# EAGLE schematic hw_DAA (EAGLE 7.6.0), part 4 of 4
## Sheet 32 of 34: FPD-Link III Deserializer
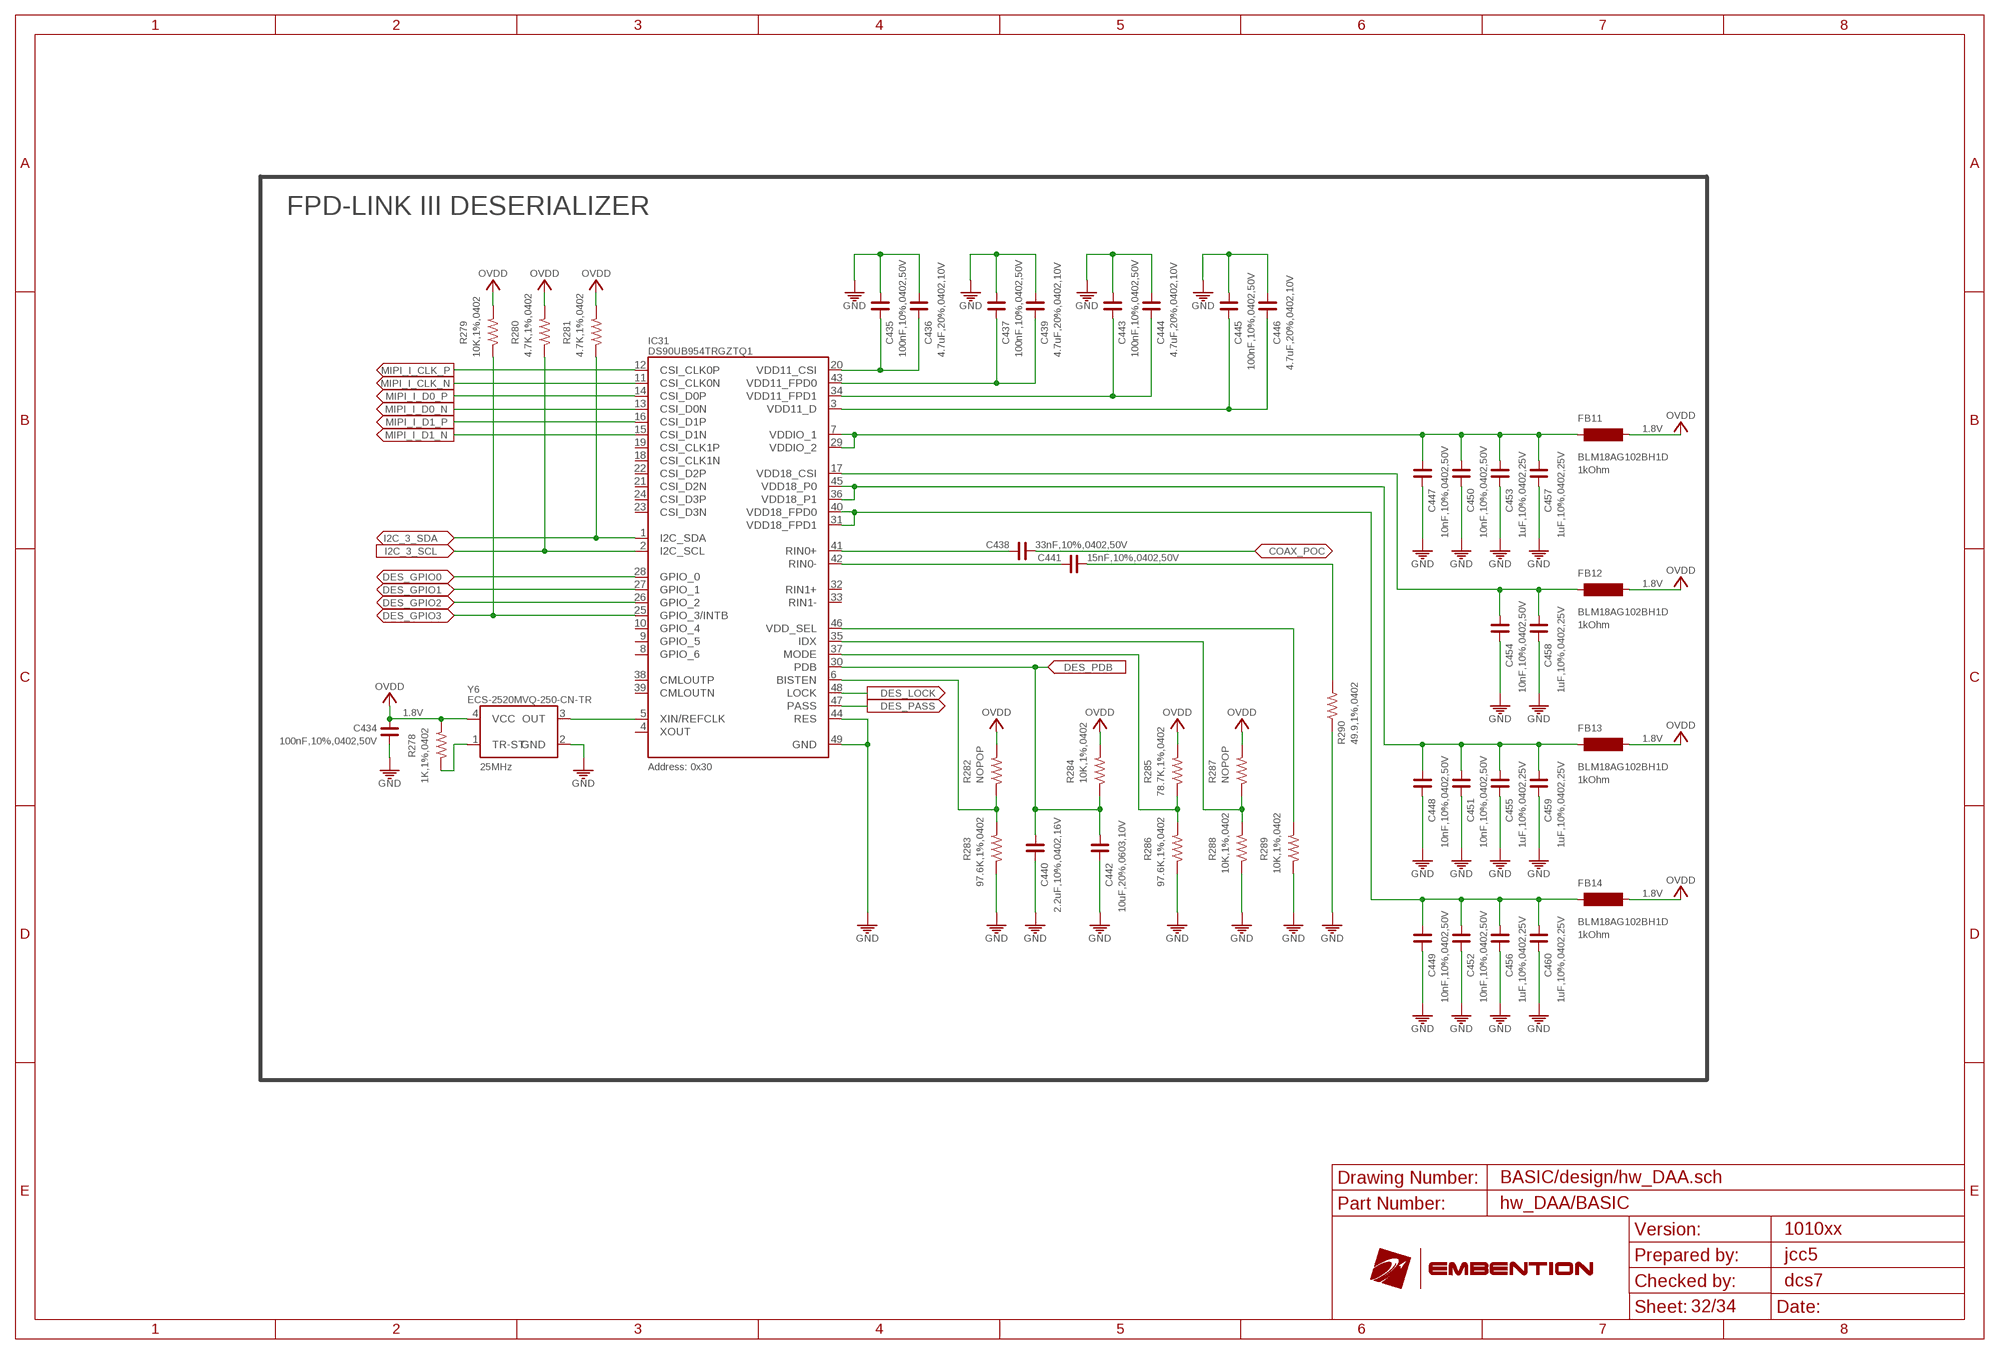
[diagram p31: schematic, sheet 32]

### Parts
C434  100nF,10%,0402,50V  C_0402  [C0402]
C435  100nF,10%,0402,50V  C_0402  [C0402]
C436  4.7uF,20%,0402,10V  C_0402  [C0402]
C437  100nF,10%,0402,50V  C_0402  [C0402]
C438  33nF,10%,0402,50V  C_0402  [C0402]
C439  4.7uF,20%,0402,10V  C_0402  [C0402]
C440  2.2uF,10%,0402,16V  C_0402  [C0402]
C441  15nF,10%,0402,50V  C_0402  [C0402]
C442  10uF,20%,0603,10V  C_0603  [C0603]
C443  100nF,10%,0402,50V  C_0402  [C0402]
C444  4.7uF,20%,0402,10V  C_0402  [C0402]
C445  100nF,10%,0402,50V  C_0402  [C0402]
C446  4.7uF,20%,0402,10V  C_0402  [C0402]
C447  10nF,10%,0402,50V  C_0402  [C0402]
C448  10nF,10%,0402,50V  C_0402  [C0402]
C449  10nF,10%,0402,50V  C_0402  [C0402]
C450  10nF,10%,0402,50V  C_0402  [C0402]
C451  10nF,10%,0402,50V  C_0402  [C0402]
C452  10nF,10%,0402,50V  C_0402  [C0402]
C453  1uF,10%,0402,25V  C_0402  [C0402]
C454  10nF,10%,0402,50V  C_0402  [C0402]
C455  1uF,10%,0402,25V  C_0402  [C0402]
C456  1uF,10%,0402,25V  C_0402  [C0402]
C457  1uF,10%,0402,25V  C_0402  [C0402]
C458  1uF,10%,0402,25V  C_0402  [C0402]
C459  1uF,10%,0402,25V  C_0402  [C0402]
C460  1uF,10%,0402,25V  C_0402  [C0402]
FB11  BLM18AG102BH1D  BLM18HE152SZ1D  [L0603]
FB12  BLM18AG102BH1D  BLM18HE152SZ1D  [L0603]
FB13  BLM18AG102BH1D  BLM18HE152SZ1D  [L0603]
FB14  BLM18AG102BH1D  BLM18HE152SZ1D  [L0603]
IC31  DS90UB954TRGZTQ1  DS90UB954-Q1  [VQFN-48]
R278  1K,1%,0402  R_0402  [R0402]
R279  10K,1%,0402  R_0402  [R0402]
R280  4.7K,1%,0402  R_0402  [R0402]
R281  4.7K,1%,0402  R_0402  [R0402]
R282  NOPOP  R_0402  [R0402]
R283  97.6K,1%,0402  R_0402  [R0402]
R284  10K,1%,0402  R_0402  [R0402]
R285  78.7K,1%,0402  R_0402  [R0402]
R286  97.6K,1%,0402  R_0402  [R0402]
R287  NOPOP  R_0402  [R0402]
R288  10K,1%,0402  R_0402  [R0402]
R289  10K,1%,0402  R_0402  [R0402]
R290  49.9,1%,0402  R_0402  [R0402]
Y6  ECS-2520MVQ-250-CN-TR  [ECS-2520MVQ]

### Nets
COAX_DES [COAX_50]: C438.1 IC31.41(RIN0+)
COAX_POC [COAX_50]: C438.2 ; also sheet 2,31
DES_GPIO0: IC31.28(GPIO_0) ; also sheet 17
DES_GPIO1: IC31.27(GPIO_1) ; also sheet 17
DES_GPIO2: IC31.26(GPIO_2) ; also sheet 17
DES_GPIO3: IC31.25(GPIO_3/INTB) R279.1 ; also sheet 17
DES_IDX: IC31.35(IDX) R287.1 R288.2
DES_LOCK: IC31.48(LOCK) ; also sheet 17
DES_MODE: IC31.37(MODE) R285.1 R286.2
DES_PASS: IC31.47(PASS) ; also sheet 17
DES_PDB: C440.1 C442.1 IC31.30(PDB) R284.1 ; also sheet 17
DES_VDD11_CSI: C435.2 C436.2 IC31.20(VDD11_CSI)
DES_VDD11_D: C445.2 C446.2 IC31.3(VDD11_D)
DES_VDD11_FPD0: C437.2 C439.2 IC31.43(VDD11_FPD0)
DES_VDD11_FPD1: C443.2 C444.2 IC31.34(VDD11_FPD1)
DES_VDD18_CSI: C454.1 C458.1 FB12.1 IC31.17(VDD18_CSI)
DES_VDD18_FPD: C449.1 C452.1 C456.1 C460.1 FB14.1 IC31.31(VDD18_FPD1) IC31.40(VDD18_FPD0)
DES_VDD18_P: C448.1 C451.1 C455.1 C459.1 FB13.1 IC31.36(VDD18_P1) IC31.45(VDD18_P0)
DES_VDD_SEL: IC31.46(VDD_SEL) R289.2
DES_VDDIO: C447.1 C450.1 C453.1 C457.1 FB11.1 IC31.7(VDDIO_1) IC31.29(VDDIO_2)
DES_XIN: IC31.5(XIN/REFCLK) Y6.3(OUT)
FPD_I_25MHZ_EN: R278.1 Y6.1(TR-ST)
FPD_I_BISTEN: IC31.6(BISTEN) R282.1 R283.2
GND: C434.2 C435.1 C436.1 C437.1 C439.1 C440.2 C442.2 C443.1 C444.1 C445.1 C446.1 C447.2 C448.2 C449.2 C450.2 C451.2 C452.2 C453.2 C454.2 C455.2 C456.2 C457.2 C458.2 C459.2 C460.2 IC31.44(RES) IC31.49(GND) R283.1 R286.1 R288.1 R289.1 R290.1 Y6.2(GND) ; also sheet 2,3,4,5,6,7,8,9,10,11,12,13,14,15,17,18,20,21,22,23,24,25,26,27,28,29,30,31,33
I2C_3_SCL: IC31.2(I2C_SCL) R280.1 ; also sheet 17
I2C_3_SDA: IC31.1(I2C_SDA) R281.1 ; also sheet 17
MIPI_I_CLK_N [DIFF100]: IC31.11(CSI_CLK0N) ; also sheet 17
MIPI_I_CLK_P [DIFF100]: IC31.12(CSI_CLK0P) ; also sheet 17
MIPI_I_D0_N [DIFF100]: IC31.13(CSI_D0N) ; also sheet 17
MIPI_I_D0_P [DIFF100]: IC31.14(CSI_D0P) ; also sheet 17
MIPI_I_D1_N [DIFF100]: IC31.15(CSI_D1N) ; also sheet 17
MIPI_I_D1_P [DIFF100]: IC31.16(CSI_D1P) ; also sheet 17
N$101: C441.2 IC31.42(RIN0-)
N$105: C441.1 R290.2
OVDD: C434.1 FB11.2 FB12.2 FB13.2 FB14.2 R278.2 R279.2 R280.2 R281.2 R282.2 R284.2 R285.2 R287.2 Y6.4(VCC) ; also sheet 9,28,29,30,31
Unconnected: IC31.4(XOUT) IC31.8(GPIO_6) IC31.9(GPIO_5) IC31.10(GPIO_4) IC31.18(CSI_CLK1N) IC31.19(CSI_CLK1P) IC31.21(CSI_D2N) IC31.22(CSI_D2P) IC31.23(CSI_D3N) IC31.24(CSI_D3P) IC31.32(RIN1+) IC31.33(RIN1-) IC31.38(CMLOUTP) IC31.39(CMLOUTN)

### Notes on the sheet
- FPD-LINK III DESERIALIZER
- 1.8V
- 1kOhm
- 1.8V
- 1kOhm
- 1.8V
- 1.8V
- 25MHz | Address: 0x30
- 1kOhm
- 1.8V
- 1kOhm
- BASIC/design/hw_DAA.sch
- hw_DAA/BASIC
- 1010xx
- jcc5
- dcs7

## Sheet 33 of 34: GPIO Level Shifter
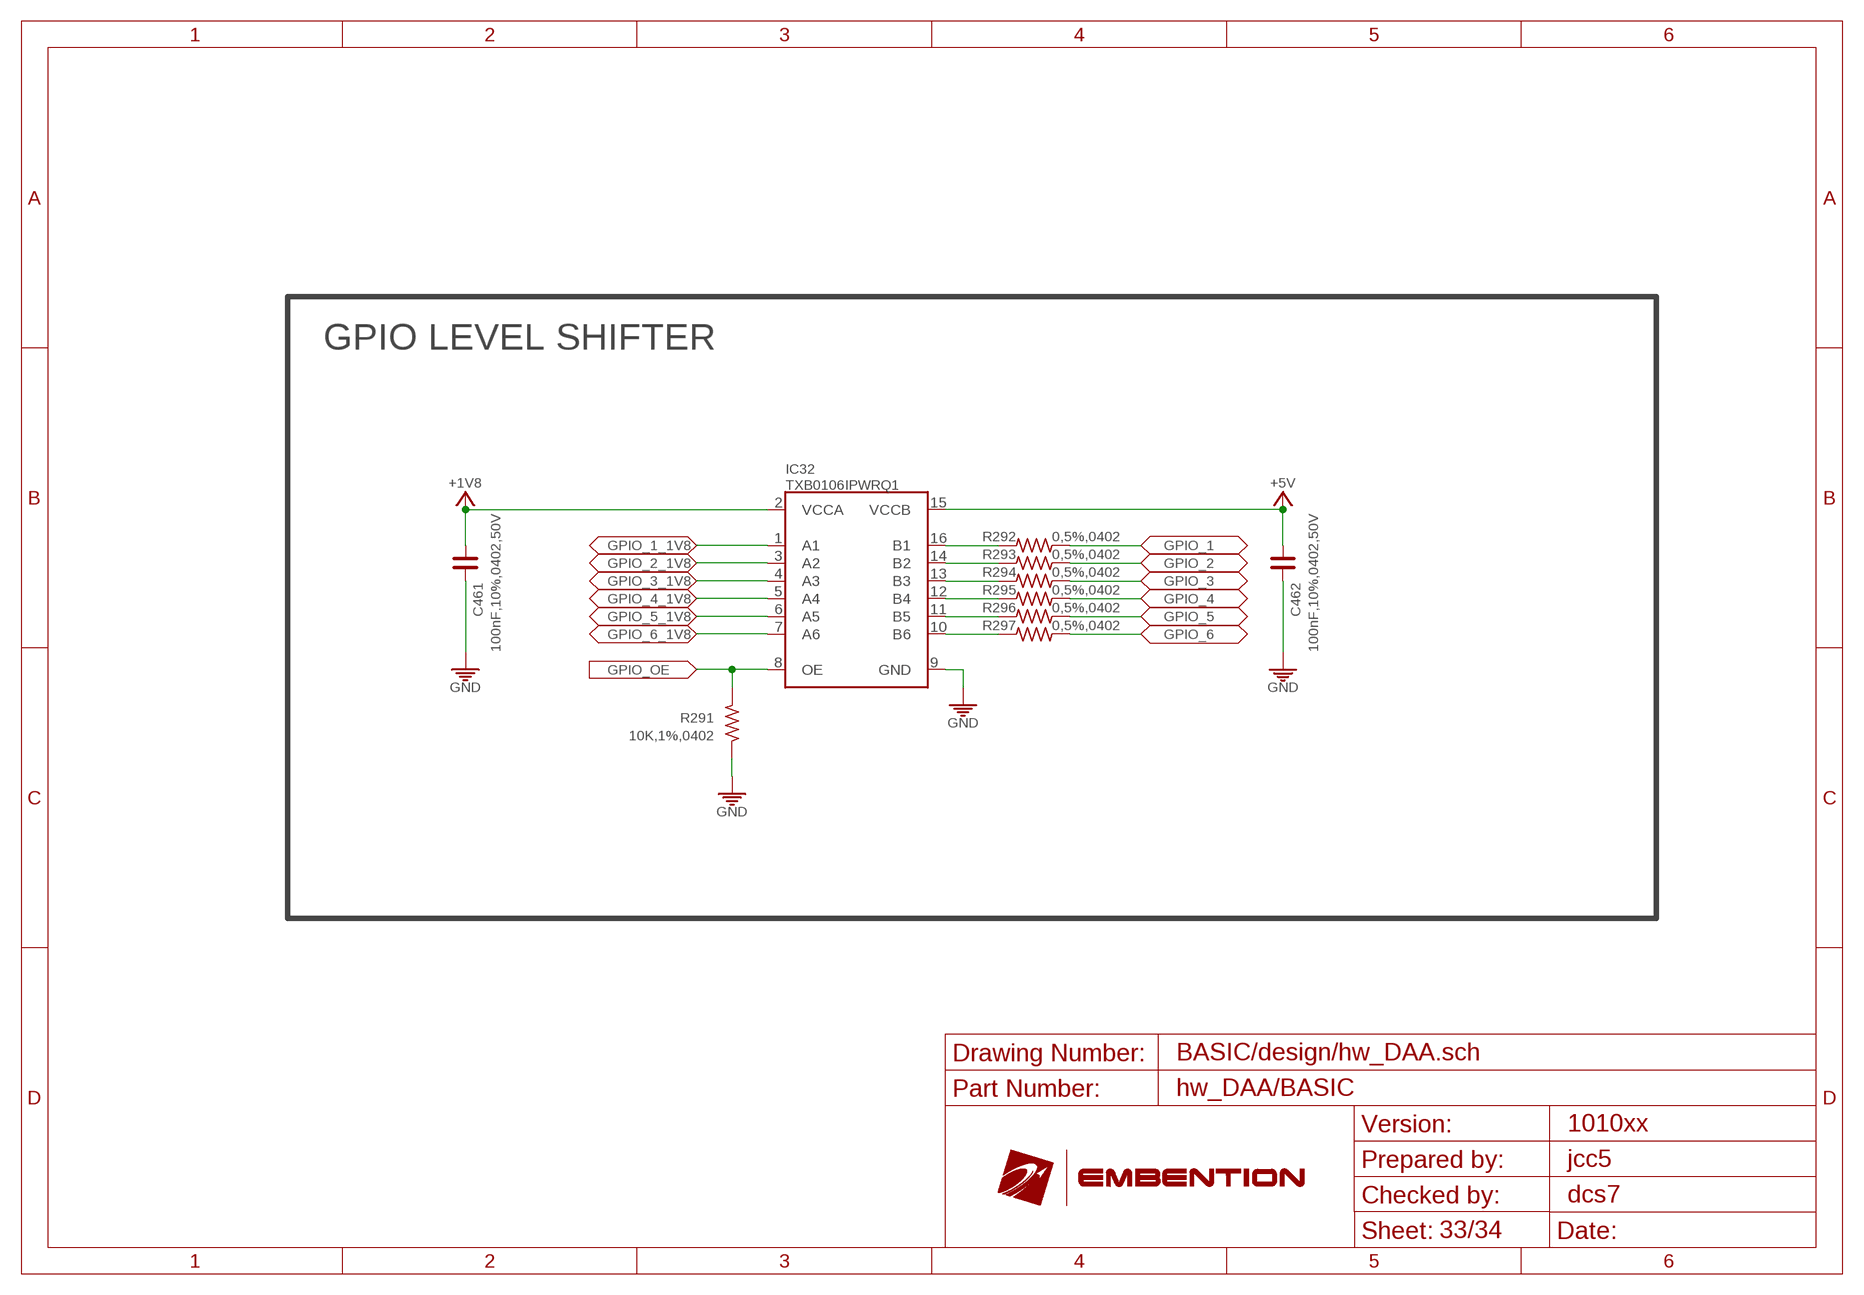
[diagram p32: schematic, sheet 33]

### Parts
C461  100nF,10%,0402,50V  C_0402  [C0402]
C462  100nF,10%,0402,50V  C_0402  [C0402]
IC32  TXB0106IPWRQ1  TXB0106-Q1  [TSSOP-16(TEXAS)]
R291  10K,1%,0402  R_0402  [R0402]
R292  0,5%,0402  R_0402  [R0402]
R293  0,5%,0402  R_0402  [R0402]
R294  0,5%,0402  R_0402  [R0402]
R295  0,5%,0402  R_0402  [R0402]
R296  0,5%,0402  R_0402  [R0402]
R297  0,5%,0402  R_0402  [R0402]

### Nets
+1V8: C461.1 IC32.2(VCCA) ; also sheet 5,24,27
+5V: C462.1 IC32.15(VCCB) ; also sheet 3,4,5,7,8,25,26
GND: C461.2 C462.2 IC32.9(GND) R291.1 ; also sheet 2,3,4,5,6,7,8,9,10,11,12,13,14,15,17,18,20,21,22,23,24,25,26,27,28,29,30,31,32
GPIO_1: R292.1 ; also sheet 2
GPIO_1_1V8: IC32.1(A1) ; also sheet 17
GPIO_2: R293.1 ; also sheet 2
GPIO_2_1V8: IC32.3(A2) ; also sheet 17
GPIO_3: R294.1 ; also sheet 2
GPIO_3_1V8: IC32.4(A3) ; also sheet 17
GPIO_4: R295.1 ; also sheet 2
GPIO_4_1V8: IC32.5(A4) ; also sheet 17
GPIO_5: R296.1 ; also sheet 2
GPIO_5_1V8: IC32.6(A5) ; also sheet 17
GPIO_6: R297.1 ; also sheet 2
GPIO_6_1V8: IC32.7(A6) ; also sheet 17
GPIO_OE: IC32.8(OE) R291.2 ; also sheet 17
N$145: IC32.16(B1) R292.2
N$146: IC32.10(B6) R297.2
N$148: IC32.11(B5) R296.2
N$149: IC32.12(B4) R295.2
N$150: IC32.13(B3) R294.2
N$151: IC32.14(B2) R293.2

### Notes on the sheet
- GPIO LEVEL SHIFTER
- BASIC/design/hw_DAA.sch
- hw_DAA/BASIC
- 1010xx
- jcc5
- dcs7

## Sheet 34 of 34: Mechanical Parts
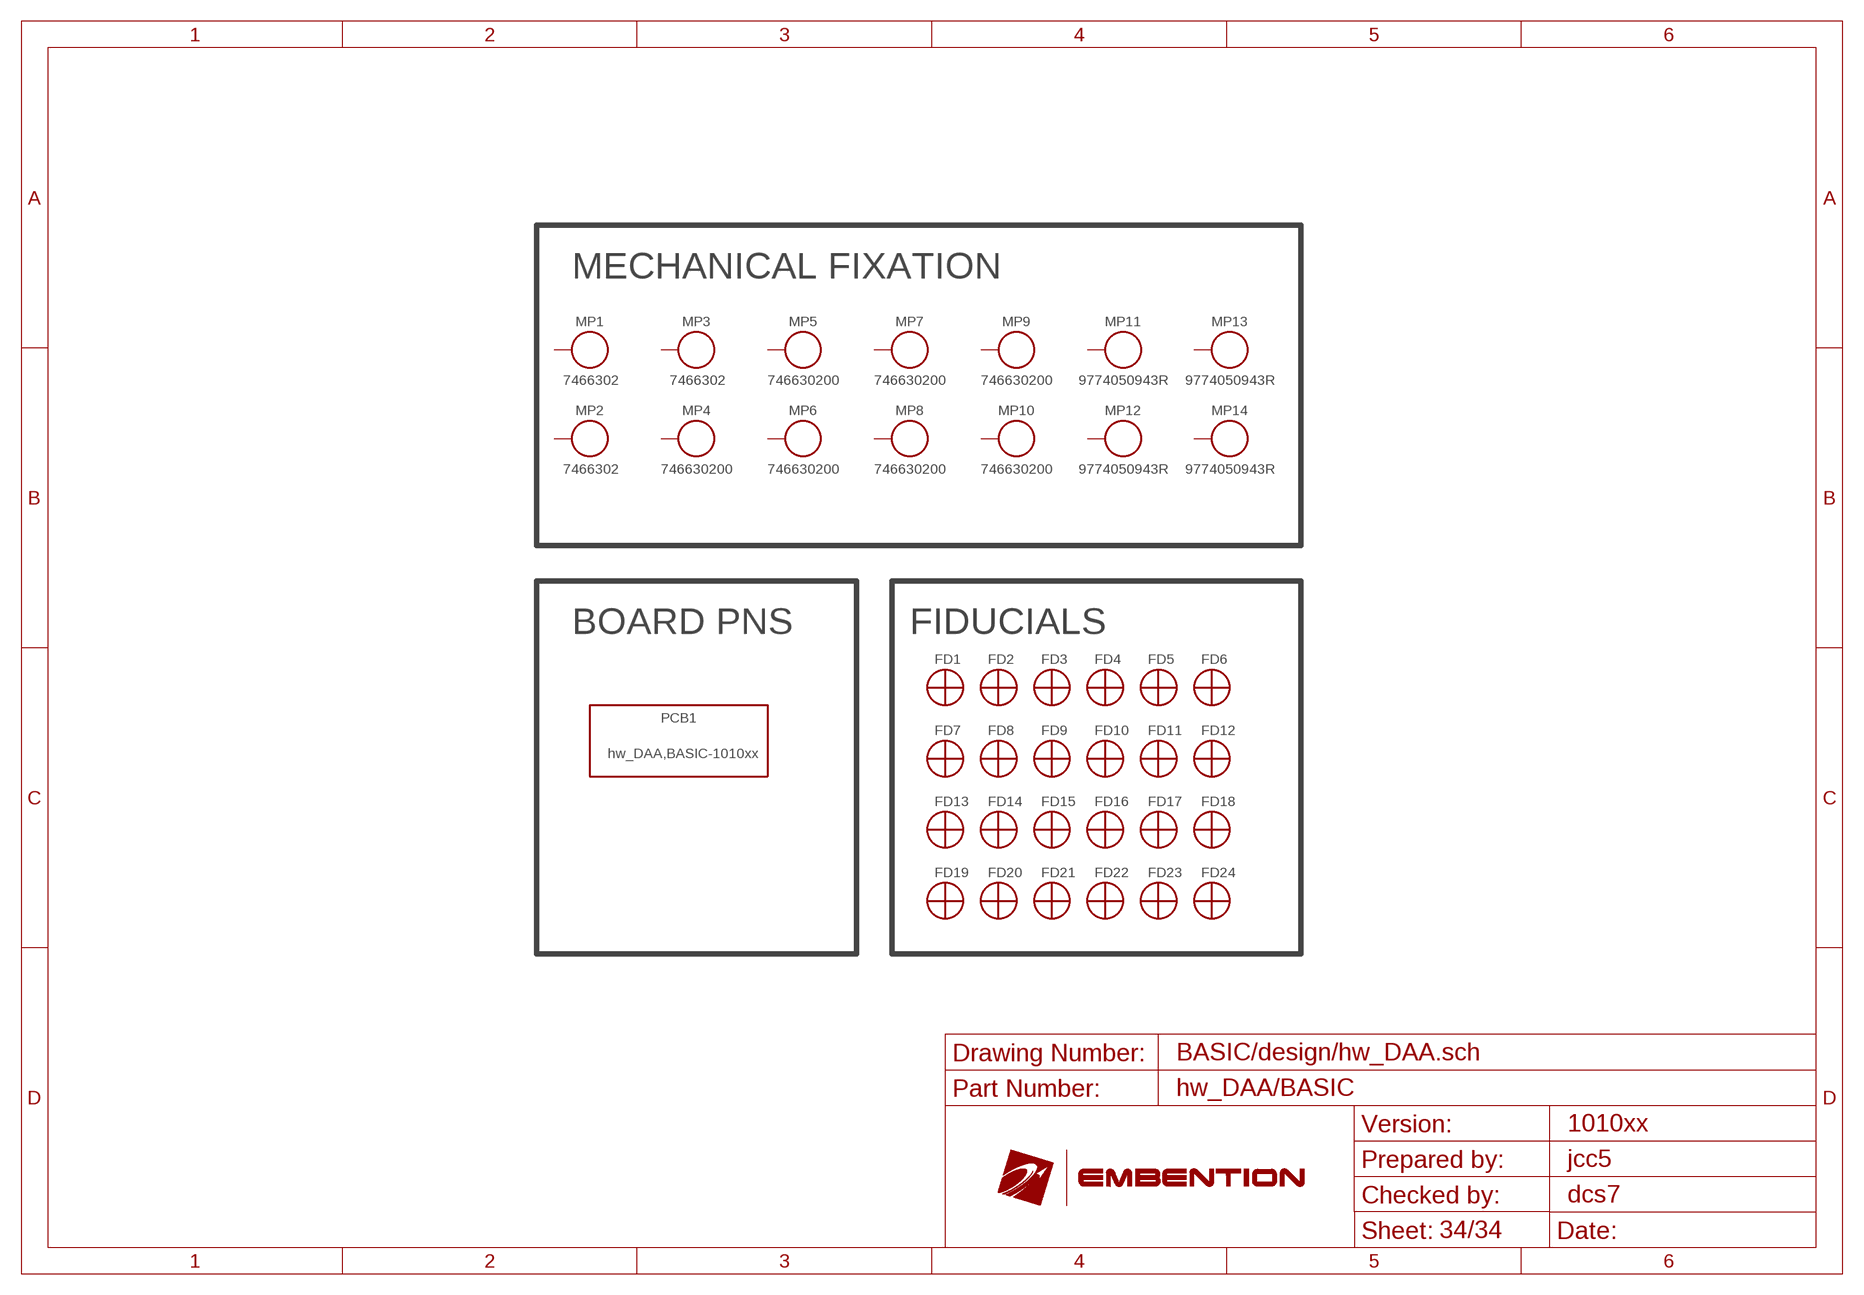
[diagram p33: schematic, sheet 34]

### Parts
FD1  NOPOP  FIDUCIAL  [FIDU]
FD2  NOPOP  FIDUCIAL  [FIDU]
FD3  NOPOP  FIDUCIAL  [FIDU]
FD4  NOPOP  FIDUCIAL  [FIDU]
FD5  NOPOP  FIDUCIAL  [FIDU]
FD6  NOPOP  FIDUCIAL  [FIDU]
FD7  NOPOP  FIDUCIAL  [FIDU]
FD8  NOPOP  FIDUCIAL  [FIDU]
FD9  NOPOP  FIDUCIAL  [FIDU]
FD10  NOPOP  FIDUCIAL  [FIDU]
FD11  NOPOP  FIDUCIAL  [FIDU]
FD12  NOPOP  FIDUCIAL  [FIDU]
FD13  NOPOP  FIDUCIAL  [FIDU]
FD14  NOPOP  FIDUCIAL  [FIDU]
FD15  NOPOP  FIDUCIAL  [FIDU]
FD16  NOPOP  FIDUCIAL  [FIDU]
FD17  NOPOP  FIDUCIAL  [FIDU]
FD18  NOPOP  FIDUCIAL  [FIDU]
FD19  NOPOP  FIDUCIAL  [FIDU]
FD20  NOPOP  FIDUCIAL  [FIDU]
FD21  NOPOP  FIDUCIAL  [FIDU]
FD22  NOPOP  FIDUCIAL  [FIDU]
FD23  NOPOP  FIDUCIAL  [FIDU]
FD24  NOPOP  FIDUCIAL  [FIDU]
MP1  7466302  WP-SMRA_746630X_746630200  [WP-SMRA_746630200]
MP2  7466302  WP-SMRA_746630X_746630200  [WP-SMRA_746630200]
MP3  7466302  WP-SMRA_746630X_746630200  [WP-SMRA_746630200]
MP4  746630200  WP-SMRA_746630X_746630200  [WP-SMRA_746630200]
MP5  746630200  WP-SMRA_746630X_746630200  [WP-SMRA_746630200]
MP6  746630200  WP-SMRA_746630X_746630200  [WP-SMRA_746630200]
MP7  746630200  WP-SMRA_746630X_746630200  [WP-SMRA_746630200]
MP8  746630200  WP-SMRA_746630X_746630200  [WP-SMRA_746630200]
MP9  746630200  WP-SMRA_746630X_746630200  [WP-SMRA_746630200]
MP10  746630200  WP-SMRA_746630X_746630200  [WP-SMRA_746630200]
MP11  9774050943R  WA-SMST_9774XXX943_9774050943R  [WA-SMST_9774050943]
MP12  9774050943R  WA-SMST_9774XXX943_9774050943R  [WA-SMST_9774050943]
MP13  9774050943R  WA-SMST_9774XXX943_9774050943R  [WA-SMST_9774050943]
MP14  9774050943R  WA-SMST_9774XXX943_9774050943R  [WA-SMST_9774050943]
PCB1  hw_DAA,BASIC-1010xx  EXTERNAL-PCB-COMPONENTS  [VOID]
Unconnected: MP1.1 MP1.2 MP1.3 MP1.4 MP2.1 MP2.2 MP2.3 MP2.4 MP3.1 MP3.2 MP3.3 MP3.4 MP4.1 MP4.2 MP4.3 MP4.4 MP5.1 MP5.2 MP5.3 MP5.4 MP6.1 MP6.2 MP6.3 MP6.4 MP7.1 MP7.2 MP7.3 MP7.4 MP8.1 MP8.2 MP8.3 MP8.4 MP9.1 MP9.2 MP9.3 MP9.4 MP10.1 MP10.2 MP10.3 MP10.4 MP11.1 MP12.1 MP13.1 MP14.1

### Notes on the sheet
- MECHANICAL FIXATION
- BOARD PNS | FIDUCIALS
- BASIC/design/hw_DAA.sch
- hw_DAA/BASIC
- 1010xx
- jcc5
- dcs7

## Library data of the parts
C1 C343 = emb-Capacitors:C_: NON-POLARIZED CAP; PNS: CAP-1nF_10%_1206_2KV.pns
C2 C110-C112 = emb-Capacitors:C_: NON-POLARIZED CAP; PNS: CAP-10uF_10%_1206_35V.pns
C3 C11 C16 C81 C82 C90 C92 = emb-Capacitors:C_: NON-POLARIZED CAP; PNS: CAP-100nF_10%_0603_100V.pns
C4 C115 C209 C212 C215 C218-C220 C222 C223 C237 C240 C243 C246-C248 C250 C251 C257 C258 C262 C263 C266-C268 C271-C275 C277 C278 C281-C283 C285 C289 C314 C317 C318 C321-C324 C326 C329 C336 C339 C361 C362 C368 C379 C383 C431-C433 C453 C455-C460 C495 = emb-Capacitors:C_: NON-POLARIZED CAP; PNS: CAP-1uF_10%_0402_25V.pns
C5 C18 C33 C36 C37 C39-C41 C46-C49 C116 C118 C123 C126 = emb-Capacitors:C_: NON-POLARIZED CAP; PNS: CAP-2.2uF_10%_0603_16V.pns
C6-C8 = emb-Capacitors:C_: NON-POLARIZED CAP; PNS: CAP-10uF_10%_2220_100V.pns
C9 C10 C79 C80 = emb-Capacitors:C_: NON-POLARIZED CAP; PNS: CAP-4.7uF_20%_1206_100V.pns
C12 = emb-Capacitors:C_: NON-POLARIZED CAP; PNS: CAP-56nF_10%_0402_16V.pns
C13 = emb-Capacitors:C_: NON-POLARIZED CAP; PNS: CAP-390pF_10%_0402_50V.pns
C14 C99 = emb-Capacitors:C_: NON-POLARIZED CAP; PNS: CAP-8.2nF_10%_0402_16V.pns
C15 C405 = emb-Capacitors:C_: NON-POLARIZED CAP; PNS: CAP-820pF_10%_0402_50V.pns
C17 = emb-Capacitors:C_: NON-POLARIZED CAP; PNS: CAP-6.8pF_5%_0603_100V.pns
C19 C20 = emb-Capacitors:C_: NON-POLARIZED CAP; PNS: CAP-6.8uF_20%_1210_50V.pns
C21 C22 C28 C50-C54 C56 C60-C62 C64 C65 C67 C68 C70 C71 C73 C87 C91 = emb-Capacitors:C_: NON-POLARIZED CAP; PNS: CAP-47uF_10%_1210_10V.pns
C23 C24 C96 = emb-Capacitors:C_: NON-POLARIZED CAP; PNS: CAP-2.7nF_5%_0603_50V.pns
C25 = emb-Capacitors:C_: NON-POLARIZED CAP; PNS: CAP-120pF_5%_0402_50V.pns
C26 C45 C76-C78 C101 C102 C117 C137 C173 C192 C193 C196 C197 C199 C221 C224-C228 C249 C252-C254 C276 C279 C280 C286 C287 C290-C292 C294-C296 C298 C299 C301-C306 C308-C313 C315 C316 C319 C320 C330 C331 C333 C334 C337 C340 C349-C351 C355-C360 C364-C367 C372-C375 C377 C380-C382 C384 C385 C387 C388 C390 C392-C396 C398 C399 C401 C402 C404 C411 C412 C415 C422 C424 C426 C434 C435 C437 C443 C445 C461 C462 C465 C468 C470 C472 C473 C478 C487-C491 C494 = emb-Capacitors:C_: NON-POLARIZED CAP; PNS: CAP-100nF_10%_0402_50V.pns
C27 C83 C93 C107 C124 C125 C175 C200 C288 C403 C416 C492 C493 = emb-Capacitors:C_: NON-POLARIZED CAP
C29 C30 C32 C35 C38 C113 C114 C119-C122 = emb-Capacitors:C_: NON-POLARIZED CAP; PNS: CAP-10uF_10%_0805_16V.pns
C31 C344 C348 C386 = emb-Capacitors:C_: NON-POLARIZED CAP; PNS: CAP-22uF_10%_1206_16V.pns
C34 C94 = emb-Capacitors:C_: NON-POLARIZED CAP; PNS: CAP-1uF_10%_0603_16V.pns
C42 C134 C171 C255 C463 C466 C469 C474 C476 C479 C481 C483 C485 = emb-Capacitors:C_: NON-POLARIZED CAP; PNS: CAP-470nF_10%_0402_16V.pns
C43 C44 = emb-Capacitors:C_: NON-POLARIZED CAP; PNS: CAP-12pF_5%_0402_50V.pns
C55 C57-C59 C63 C66 C69 C72 C74 C75 = emb-Capacitors:NFM18HC106D0G3L: NFM18HC106D0G3L 3-pin Filter Capacitor Capacitance: 10uF Voltage rating DC: 4V Tolerance: 20% Series code: C4AQ-M Temp: -55ºC to125ºC Qualification: AEC-Q200; PNS: CAP-10uF_20%_0603_4V_3L.pns
C84 C297 C300 = emb-Capacitors:C_: NON-POLARIZED CAP; PNS: CAP-4.7nF_20%_0402_100V.pns
C85 = emb-Capacitors:C_: NON-POLARIZED CAP; PNS: CAP-10pF_1%_0402_50V.pns
C86 C108 C109 = emb-Capacitors:C_: NON-POLARIZED CAP; PNS: CAP-100uF_20%_1210_6.3V.pns
C88 C89 C104 C105 C293 C327 C332 C338 C342 C345 C352 C369 C371 C378 C418 C420 C423 C427 C442 = emb-Capacitors:C_: NON-POLARIZED CAP; PNS: CAP-10uF_20%_0603_10V.pns
C95 C98 = emb-Capacitors:C_: NON-POLARIZED CAP; PNS: CAP-3.3nF_10%_0402_50V.pns
C97 C100 C194 C195 = emb-Capacitors:C_: NON-POLARIZED CAP; PNS: CAP-22pF_0.25pF_0402_50V.pns
C103 C408 = emb-Capacitors:C_: NON-POLARIZED CAP; PNS: CAP-220nF_10%_0402_35V.pns
C106 = emb-Capacitors:C_: NON-POLARIZED CAP; PNS: CAP-330pF_10%_0402_50V.pns
C127 C140 C152 C155 C156 C158 C159 C163 = emb-Capacitors:C_: NON-POLARIZED CAP; PNS: CAP-47uF_20%_0603_4V.pns
C128 C141-C143 C145-C148 C151 C153 C154 C157 C162 C165 C166 C169 C170 C174 C176-C178 C180 C181 C185 C187 = emb-Capacitors:C_: NON-POLARIZED CAP; PNS: CAP-10uF_20%_0402_4V.pns
C129 C160 = emb-Capacitors:C_: NON-POLARIZED CAP; PNS: CAP-330uF_20%_1210_2.5V.pns
C130-C133 C136 C161 C164 C167 C168 C172 C179 C182-C184 C186 C188-C190 = emb-Capacitors:C_: NON-POLARIZED CAP; PNS: CAP-100uF_20%_0805_4V.pns
C135 C138 C139 C144 C149 C150 C201-C208 C210 C211 C229-C236 C238 C239 C259-C261 C264 C265 C346 C347 C353 C354 C363 C370 C376 C389 C391 C397 C400 C406 C407 C409 C410 C436 C439 C444 C446 = emb-Capacitors:C_: NON-POLARIZED CAP; PNS: CAP-4.7uF_20%_0402_10V.pns
C191 = emb-Capacitors:C_: NON-POLARIZED CAP; PNS: CAP-33pF_5%_0402_50V.pns
C198 = emb-Capacitors:C_: NON-POLARIZED CAP; PNS: CAP-100pF_5%_0402_50V.pns
C213 C214 C216 C217 C241 C242 C244 C245 C269 C270 C417 C440 = emb-Capacitors:C_: NON-POLARIZED CAP; PNS: CAP-2.2uF_10%_0402_16V.pns
C256 C464 C467 C471 C475 C477 C480 C482 C484 C486 = emb-Capacitors:C_: NON-POLARIZED CAP; PNS: CAP-68nF_10%_0402_50V.pns
C284 C307 C325 C328 C335 C341 C413 C421 C425 C428-C430 C447-C452 C454 = emb-Capacitors:C_: NON-POLARIZED CAP; PNS: CAP-10nF_10%_0402_50V.pns
C414 = emb-Capacitors:C_: NON-POLARIZED CAP; PNS: CAP-22nF_10%_0402_50V.pns
C419 C441 = emb-Capacitors:C_: NON-POLARIZED CAP; PNS: CAP-15nF_10%_0402_50V.pns
C438 = emb-Capacitors:C_: NON-POLARIZED CAP; PNS: CAP-33nF_10%_0402_50V.pns
CN1 = emb-Connectors:HEW.LM.368.XLNP: LEMO Connector 68 pin HEW.LM.368.XLNP Fixed receptacle, nut fixing, watertight with straight contact for printed circuit, Female Contact Drawing Rev. 00 Source: http://www.lemo.com/catalog/ROW/UK_English/M_series.pdf; MPN: HEW.LM.368.XLNP; OC_FARNELL: unknown; OC_NEWARK: unknown
CN2 = emb-Connectors:132203-18: 132203-18 RF CONN Connector Style SMA Connector Type Jack, Female Socket Impedance 50Ohm Mounting Type Panel Mount, Through Hole, Right Angle Frequency - Max 12.4 GHz Ingress Protection IP67 - Dust Tight, Waterproof Operating Temperature -65°C ~ 165°C; PNS: CONN-132203-18.pns
CN3 CN5 = emb-Connectors:CLP-105-02-F-D-BE: CLP-105-02-F-D-BE Connector SAMTEC Current Rating: 3.4 A Voltage Rating: 280 VAC, 395 VDC Pitch: 1.27 mm Mounting Angle: Vertical Bottom Entry Temperature: -55ºC to 125ºC; PNS: CONN-CLP-105-02-F-D-BE.pns
CN4 = emb-Connectors:CLP-106-02-F-D-BE: CLP-106-02-F-D-BE Connector SAMTEC Current Rating: 3.4 A Voltage Rating: 280 VAC, 395 VDC Pitch: 1.27 mm Mounting Angle: Vertical Bottom Entry Temperature: -55ºC to 125ºC; PNS: CONN-CLP-106-02-F-D-BE.pns
CN6 = emb-Connectors:SD-LATCH: SD Holder Card Type: microSD Pitch: 1.1 mm Brand: Molex Temperature: -20ºC to 85ºC Same components as 47219-2001 but with 4-bit SDIO interface; PNS: CONN-47219-2001_.pns
CN7 = emb-Connectors:SFW15S-2STE1LF: SFW15S-2STE1LF Amphenol FFC/FPC Connector Number of contacts: 15 Number of rows: 2 Pitchs: 1mm Temperature range: -55ºC to 105ºC Voltage rating: 100V Rated current: 1A
D1 D2 = emb-diodes:SZ1SMA36CAT3G: SZ1SMA36CAT3G Product Type: TVS Diodes Polarity: Bidirectional Working Voltage: 36 V Package/Case: SMA-2 Pppm - Peak Pulse Power Dissipation: 400 W Vesd - Voltage ESD Contact: 16 kV Vesd - Voltage ESD Air Gap: 16 kV Temperature: -65ºC to 150ºC Qualification: AEC-Q101; PNS: DIO-SMA6J64CA.pns
D3 D4 = emb-diodes:PESD2CANFD27V-UX: PESD2CANFD27V-UX CAN-FD TVS Polarity: Bidirectional Number of Channels: 2 Channel Working Voltage: 27 V Clamping Voltage: 33 V Breakdown Voltage: 38 V Package/Case: SOT323-3 Ipp - Peak Pulse Current: 2.5 A Cd - Diode Capacitance: 5.2 pF Qualification: AEC-Q101 Temperature: -55ºC to 175ºC; PNS: DIO-PESD2CANFD27V-UX.pns
D5 = emb-diodes:SP712-02HTG: SP712-02HTG ESD Suppressor / TVS Diode Polarity: Bidirectional Working Voltage: 12V/7V Number of Channels: 2 Channel Package/Case: SOT-23-3 Breakdown Voltage: 13.3V/7.5V Clamping Voltage: 20V/ Pppm - Peak Pulse Power Dissipation: 500 W Vesd - Voltage ESD Contact: 30 kV Vesd - Voltage ESD Air Gap: 30 kV Ipp - Peak Pulse Current: 20 A Qualification: AEC-Q101 Temperature: -40ºC to 150ºC; PNS: DIO-PESD15VL2BT-QR.pns
D6 D7 = emb-diodes:SP712-02HTG: SP712-02HTG ESD Suppressor / TVS Diode Polarity: Bidirectional Working Voltage: 12V/7V Number of Channels: 2 Channel Package/Case: SOT-23-3 Breakdown Voltage: 13.3V/7.5V Clamping Voltage: 20V/ Pppm - Peak Pulse Power Dissipation: 500 W Vesd - Voltage ESD Contact: 30 kV Vesd - Voltage ESD Air Gap: 30 kV Ipp - Peak Pulse Current: 20 A Qualification: AEC-Q101 Temperature: -40ºC to 150ºC; PNS: DIO-SP712-02HTG.pns
D8 D9 = emb-diodes:PMEG10030ELPX: PMEG10030ELPX Product: Schottky Rectifiers Package/Case: SOD-128-2 If - Forward Current: 3 A Vrrm - Repetitive Reverse Voltage: 100 V Vf - Forward Voltage: 710 mV Temperature: -55ºC to 175ºC Qualification: AEC-Q101 Pd - Power Dissipation: 2.5 W; PNS: DIO-STPS5H100AFY.pns
D10-D12 D26 = emb-diodes:GSOT05C-HE3-08: GSOT05C-HE3-08 TVS Diode Working Voltage: 5V Breakdown Voltage: 6V Clamping Voltage: 16V Polarity: Unidirectional Package/Case: SOT-23-3 Power - Peak Pulse: 480W Qualification: AEC-Q101 Temperature: -40ºC to 250ºC; PNS: DIO-GSOT05C-HE3-08.pns
D13 = emb-diodes:PESD0402-140: PESD0402-140 ESD Suppressor Working Voltage: 14 V Clamping Voltage: 40 V Vesd - Voltage ESD Contact: 8 kV Vesd - Voltage ESD Air Gap: 15 kV Cd - Diode Capacitance: 0.25 pF Temperature: -55ºC to 125ºC Qualification: AEC-Q200 Package: 0402
D14 D15 = emb-diodes:BZD27C10P-HE3-08: BZD27C10P-HE3-08 Zener diode Product Category: Zener Diodes Vz - Zener Voltage: 10 V Package/Case: DO-219AB-2 Voltage Tolerance: 5 % Pd - Power Dissipation: 800 mW Temperature: -65ºC to 175ºC Qualification: AEC-Q101; PNS: DIO-BZD27C10P-HE3-08.pns
D16-D18 D20-D22 D28 = emb-diodes:RCLAMP3324PQTCT: RCLAMP3324PQTCT Unidirectional TVS Polarity: Unidirectional Number of Channels: 4 Channel Working Voltage: 3.3 V Clamping Voltage: 4.5 V Breakdown Voltage: 8 V Package/Case: DFN-2510-10 Ipp - Peak Pulse Current: 4.5 A Cd - Diode Capacitance: 0.65 pF Qualification: AEC-Q100 Temperature: -40ºC to 125ºC; PNS: DIO-RCLAMP3324PQTCT.pns
D19 = emb-diodes:BZT52C3V3-7-F: BZT52C3V3-7-F Zener Diode Vz - Zener Voltage: 3.3 V Package/Case: SOD-123-2 Pd - Power Dissipation: 500 mW Zener Current: 5 mA Qualification: AEC-Q101 Temperature range: -65ºC to 150ºC; PNS: DIO-BZT52C3V3-7-F.pns
D23 = emb-diodes:AQ4020-01FTG: AQ4020-01FTG Polarity: Unidirectional Working Voltage: 3.3 V Package/Case: SOD-323-2 Breakdown Voltage: 3.5 V Clamping Voltage: 21.8 V Pppm - Peak Pulse Power Dissipation: 750 W Vesd - Voltage ESD Contact: 30 kV Vesd - Voltage ESD Air Gap: 30 kV Ipp - Peak Pulse Current: 25 A Cd - Diode Capacitance: 2.5 pF Temperature: -40ºC to 125ºC Qualification: AEC-Q101; PNS: DIO-AQ4020-01FTG.pns
D24 D25 D27 = emb-diodes:HSP051-4M10: HSP051-4M10 Product Type: ESD Suppressors Polarity: Unidirectional Working Voltage: 3.6 V Number of Channels: 4 Channel Package/Case: USON-10 Breakdown Voltage: 5.8 V Clamping Voltage: 10V Vesd - Voltage ESD Contact: 8 kV esd - Voltage ESD Air Gap: 15 kV Cd - Diode Capacitance: 0.55 pF Temperature: -40ºC to 150ºC; PNS: DIO-HSP051-4M10.pns
FB1-FB3 = emb-Ferrites:BLM18HE152SZ1D: BLM18HE152SZ1D Rated Current: 500 mA Impedance @ 100 MHz: 1500 Ohms DC Resistance: 500 mOhms Manufacturer: Murata; PNS: FER-BLM18HE152SZ1D.pns
FB4-FB7 = emb-Ferrites:BLM15PX121SH1D: BLM15PX121SH1D Rated Current: 2 A Impedance @ 100 MHz: 120 Ohms DC Resistance: 55 mOhms Qualification: AEC-Q200; PNS: FER-BLM15PX121SH1D.pns
FB8-FB14 = emb-Ferrites:BLM18HE152SZ1D: BLM18HE152SZ1D Rated Current: 500 mA Impedance @ 100 MHz: 1500 Ohms DC Resistance: 500 mOhms Manufacturer: Murata; PNS: FER-BLM18AG102BH1D.pns
FD1-FD24 = emb-Others:FIDUCIAL: FIDUCIAL 1.3MM
IC1 = emb-IC:LM5146-Q1: LM5146-Q1 100-V Synchronous Buck DC/DC Controller With Wide Duty Cycle Range Input Voltage DCDC: 5.5V to 100V Output Voltage: 0.8V to 60V Package: VQFN-20 Temperature range: -40ºC to 125ºC Qualification:AEC-Q100; PNS: IC-LM5146QRGYRQ1.pns
IC2 IC8 = emb-IC:TPS57112C-Q1: TPS57112C-Q1 Automotive 2.95-V to 6-V, 2-A, 2-MHz Synchronous Buck Converter Input Voltage DCDC: 2.95V to 6V Input Voltage LDO: 1.6V to 6V Output Voltage: Ajustable Interfaces: DDR2, DDR3, DDR3L, DDR4 Package: WQFN-16 Temperature range: -40ºC to 150ºC Qualification:AEC-Q100; PNS: IC-TPS57112CQRTERQ1.pns
IC3 = emb-IC:TPS6593-Q1: TPS6593-Q1 Power Management IC (PMIC) with 5 BUCKs and 4 LDOs for SafetyRelevant Automotive Applications Input Voltage 3V to 5.5V Output Voltage: Ajustable Package: VQFNP-56 Temperature range: -40ºC to 125ºC Qualification:AEC-Q100; PNS: IC-TPS65930400RWERQ1.pns
IC4 = emb-IC:TCA9517-Q1: TCA9517-Q1 Level-Shifting I2C Bus Repeater Voltage Input A: 0.9V to 5.25V Voltage Input B: 2.7V to 5.25V Package/Case: VSSOP-8 Qualification: AEC-Q100; PNS: IC-TCA9517DGKRQ1.pns
IC5 = emb-IC:TS5A23157-Q1: TS5A23157-Q1 Dual 15-Ω SPDT Analog Switch Input Voltage DCDC: 1.8V to 5.5V Protocols: Analog, I2C, LVDS, UART Configuration: 2:1 SPDT Ron (typ) (Ω): 15 Number of channels: 2 Package: VSSOP-10 Temperature range: -40ºC to 125ºC Qualification:AEC-Q100; PNS: IC-TS5A23157TDGSRQ1.pns
IC6 = emb-IC:TPS62873-Q1: TPS62873-Q1 2.7-V to 6-V Input, 6-A, 9-A, 12-A, 15-A, Stackable, Synchronous StepDown Converters with Fast Transient Response Input Voltage: 2.7V to 6V Output Voltage: Ajustable Output Current: 15A Package: WQFN-16 Temperature range: -40ºC to 150ºC Qualification:AEC-Q100; PNS: IC-TPS62873QWRXSRQ1.pns
IC7 = emb-IC:TPS54116-Q1: TPS54116-Q1 2.95-V to 6-V Input, 4-A Step-Down Converter and 1-A Source/Sink DDR Termination Regulator Input Voltage DCDC: 2.95V to 6V Input Voltage LDO: 1.6V to 6V Output Voltage: Ajustable Interfaces: DDR2, DDR3, DDR3L, DDR4 Package: WQFN-24 Temperature range: -40ºC to 150ºC Qualification:AEC-Q100; PNS: IC-TPS54116QRTWTQ1.pns
IC9 = emb-IC:TPS650330-Q1: TPS650330-Q1 Automotive Camera PMIC Input Voltage DCDC: 4V to 18V Input Voltage LDO: 1.6V to 6V Output Voltage: Ajustable Interfaces: DDR2, DDR3, DDR3L, DDR4 Package: VQFN-24 Temperature range: -40ºC to 125ºC Qualification:AEC-Q100; PNS: IC-TPS65033000RGERQ1.pns
IC10 = emb-IC:TPS745-Q1: TPS745-Q1 Automotive, 500-mA LDO With Power-Good in Small Wettable Flank WSON Packages Input Voltage: 1.5V to 6V Output Voltage: Adjustable/Fixed Package: VSON-8 Temperature range: -40ºC to 150ºC Qualification:AEC-Q100; PNS: IC-TPS74525PQWDRBRQ1.pns
IC11 = emb-IC:XCZU15EG-FFVB1156: XCZU15EG-FFRB1156 Xilinx SoC FPGA Family: Zynq Ultrascale+ MPSoC Sub-Family: EG (Broad Device Range for Next-Generation Applications) Package: FFVB1156 Application Processing Unit: Quad-core Arm® Cortex®-A53 MPCore™ up to 1.5GHz Real-Time Processing Unit: Dual-core Arm Cortex-R5F MPCore™ up to 600MHz Graphics Processing Unit: Arm Mali™-400 MP2 up to 667MHz Dynamic Memory Interface: DDR4, LPDDR4, DDR3, DDR3L, LPDDR3 High-Speed Peripherals: PCIe® Gen2, USB3.0, SATA 3.1, DisplayPort, Gigabit Ethernet System Logic Cells: 747K Total RAM: 69Mb DSP Slices: 3528 16.3 Gb/s Transceivers: 24 32.75 Gb/s Transceivers: 0 PCI Express: 0 Maximum I/O Pins: 328; PNS: IC-XCZU15EG-2FFVB1156I.pns
IC12 = emb-IC:SN74LVC1G08QDCKRQ1: SN74LVC1G08QDCKR-Q1 Texas instruments AND gate Logic Function: AND Number of Gates: 1 Gate Supply Voltage range: 1.65V to 5.5V Temperature: -40ºC to 125ºC Package/Case: SC70-5 Qualification: AEC-Q100; PNS: IC-SN74LVC1G08QDCKRQ1.pns
IC13 = emb-IC:TMP451-Q1: TMP451A-Q1 Digital Temperature Sensor with Two-Wire Interface and Alert Sensing: Remote and Local Accuracy: ±1°C Resolution: 12bits Package: WSON-8 Temperature range: -40ºC to 125ºC Qualification:AEC-Q100; PNS: IC-TMP451HQDQFRQ1.pns
IC14-IC18 = emb-IC:MT40A1G16TD-062E: MT40A1G16TD-062E Micron DDR4 SDRAM Configuration: 1Gbx16 Density: 16Gb Bus Width: x16 Timing - Cycle time: DDR4-3200 Package: 96-ball FBGA; PNS: IC-MT40A1G16TD-062E AAT_F.pns
IC19 = emb-IC:SN74LVC1G04QDCKRQ1: SN74LVC1G04QDCKRQ1 Automotive single 1.65-V to 5.5-V inverter Logic Function: Inverting Number of Gates: 1 Gate Supply Voltage range: 1.65V to 5.5 V Temperature: -40ºC to 125ºC Package/Case: SC70-5 Qualification: AEC-Q100; PNS: IC-SN74LVC1G04QDCKRQ1.pns
IC20 = emb-IC:NVT4858HK: NVT4858HK SD 3.0-SDR104 compliant integrated auto-direction control without internal LDO Supply Voltage range: 1.1V to 3.6V Temperature: -40ºC to 85ºC Package/Case: XQFN16; PNS: IC-NVT4858HK.pns
IC21 IC22 = emb-IC:TPS2291XX: TPS2291xx Ultra-small, Low On Resistance Load Switch With Controlled Turn-on Input Voltage 1.4V to 5.5V Package: DSBGA-4 Temperature range: -40ºC to 85ºC; PNS: IC-TPS22910AYZVR.pns
IC23 IC24 = emb-IC:TCAN1462V-Q1: TCAN1462V-Q1 CAN FD Transceiver Package/Case: SOIC-8/VSON-8 Input Voltage: 1.7V to 5.5V Data Rate: 5Mbps; PNS: IC-TCAN1462VDRBRQ1.pns
IC25 = emb-IC:SN65HVD33: SN65HVD30MDREP RS-485 Transceiver Data Rate: 25 Mb/s Duplex: Full Duplex Package: SOIC-14 Temperature range: -55ºC to 125ºC; PNS: IC-SN65HVD33MDREP.pns
IC26 = emb-IC:SN65C3221-Q1: SN65C3221-Q1 Automotive 3- to 5.5-V single channel 1Mbps RS-232 line driver/receiver Channels: 1 Data Rate: 1 MbPs Package: TSSOP-16 Temperature range: -40ºC to 85ºC; PNS: IC-SN65C3221IPWRQ1.pns
IC27 = emb-IC:DP83867ERGZ: DP83867ERGZ Robust, High Immunity, Small Form Factor 10/100/1000 Ethernet Physical Layer Transceiver Package/Case: VQFN-48 Interface: RGMII and SGMII Data Rate: 100BASE-TX and 1000BASE-T; PNS: IC-DP83867ERGZT.pns
IC28 = emb-IC:IMX296: IMX290LQR-C CMOS Solid-state Image Sensor with Square Pixel for Color Cameras Package/Case: LGA-138 Interface: MIPI (2-lanes) ans I2C Imagen Resolution: 1440x1080 ADC Converter: 10bit; PNS: IC-IMX296LQR-C.pns
IC29 = emb-IC:BMI088: BMI088 IMU combining accelerometer and gyroscope Package/Case: LGA-16 Supply Voltage: 3.3V, 1,8V Interface: I2C, SPI Data Rate: 2kHz; PNS: IC-BMI088.pns
IC30 = emb-IC:DS90UB953-Q1: DS90UB953-Q1 FPD-Link III 4.16-Gbps Serializer With CSI-2 Interface Package/Case: VQFN-32 Interface: CSI-2 Data Rate: 4.16Gbps; COPYRIGHT: Copyright (C) 2023 Ultra Librarian. All rights reserved.; MANUFACTURER_PART_NUMBER: DS90UB953TRHBRQ1; MFR_NAME: Texas Instruments
IC31 = emb-IC:DS90UB954-Q1: DS90UB954-Q1 Dual 4.16 Gbps FPD-Link III Deserializer Hub With MIPI CSI-2 Outputs Package/Case: VQFN-48 Interface: CSI-2 Data Rate: 1.6Gbps; PNS: IC-DS90UB954TRGZTQ1.pns
IC32 = emb-IC:TXB0106-Q1: TXB0106-Q1 6-Bit Bidirectional Voltage-Level Translator With Auto-Direction Sensing and ±10-kV ESD Protection Supply Voltage Range Port A: 1.2V to 3.6V Supply Voltage Range Port B: 1.65V to 5.5V Direction: Bidirectional Number of I/O: 6 Temperature: -40ºC to 85ºC Package/Case: TSSOP-16 Qualification: AEC-Q100; PNS: IC-TXB0106IPWRQ1.pns
L1 = emb-Inductors:NLCV32T-100K-EFRD: NLCV32T-100K-EFRD Inductance: 10 uH Tolerance: 10 % Maximum DC Current: 450 mA Maximum DC Resistance: 360 mOhms Temperature: -40ºC to 105ºC Qualification: AEC-Q200; PNS: IND-10uH_10%_450mA.pns
L2 L3 = emb-Inductors:XAL7030: XAL7030 Series Inductors; PNS: IND-4.7uH_20%_9A.pns
L4 = emb-Inductors:XAL50XX: XAL50xx Series Inductors; PNS: IND-2.2uH_20%_9.7A.pns
L5 L8 L9 = emb-Inductors:TFM322512ALMA; PNS: IND-220nH_20%_7A.pns
L6 L7 = emb-Inductors:TFM322512ALMA; PNS: IND-470nH_20%_5.3A.pns
L10 = emb-Inductors:XAL4020: XAL4020 Series Inductors; PNS: IND-100nH_20%_19.9A.pns
L11 = emb-Inductors:XAL4020: XAL4020 Series Inductors; PNS: IND-600nH_20%_11.7A.pns
L12 = emb-Inductors:XAL4020: XAL4020 Series Inductors; PNS: IND-1.5uH_20%_9.1A.pns
L13 = emb-Inductors:L201610: Inductors for power circuits 2mm x 1.6mm; PNS: IND-1.5uH_20%_2.3A.pns
L14 L15 = emb-Inductors:L201610: Inductors for power circuits 2mm x 1.6mm; PNS: IND-1uH_20%_3.1A.pns
L16 L17 = emb-Inductors:1812CAN: 1812CAN Series Common Mode Chokes Qualification: AEC-Q200 Package/Case: 1812 (4532 metric) Temperature: -40ºC to 125ºC Tolerance: 30 %; PNS: IND-1812CAN-113NRC.pns
MP1-MP3 = emb-Others:WP-SMRA_746630X: 746630X SMT Right Angled without Pins Dimmensions: 5mm x 7mm x 5mm Material: Brass Surface: Tin Torque: 0.4 Nm Rated Current: 50A Metric: M2 to M3; DATASHEET-URL: https://www.we-online.de/katalog/datasheet/746630200.pdf; HEIGHT: 5mm; LENGTH: 7mm; PART-NUMBER: 746630200; PNS: OTHER-7466302.pns; THREAD: M2; WIDTH: 5mm
MP4-MP10 = emb-Others:WP-SMRA_746630X: 746630X SMT Right Angled without Pins Dimmensions: 5mm x 7mm x 5mm Material: Brass Surface: Tin Torque: 0.4 Nm Rated Current: 50A Metric: M2 to M3; DATASHEET-URL: https://www.we-online.de/katalog/datasheet/746630200.pdf; HEIGHT: 5mm; LENGTH: 7mm; PART-NUMBER: 746630200; PNS: OTHER-746630200.pns; THREAD: M2; WIDTH: 5mm
MP11-MP14 = emb-Others:WA-SMST_9774XXX943: WA-SMST Steel Spacer with through hole Ø2.25 Applications Assembling of PCBs to housing and to other PCBs For distances from 1 to 8 mm Fast and precise process Strong holding forces and torques Highest process reliability Instant removable Polyimide Tape Properties Material Steel Surface Tin Ø f 2.25 mm Solder Paste Thickness 150 µm General Information Operating Temperature -55 up to +150 °C Details see: https://www.we-online.com/catalog/en/SMST_SMD_STEEL_SPACER_2_25_INTERNAL_NON_STOP Updated by Ella Wu , 2021-06-09 2021 (C) Wurth Elektronik; DATASHEET-URL: https://www.we-online.com/catalog/datasheet/9774050943R.pdf; HOLE-DIAMETER: 2.25mm; INNER-DIAMETER: 2.8mm; OUTER-DIAMETER: 4.35mm; PACKAGING: Tape and Reel; PART-NUMBER: 9774050943R; PIN-LENGTH: 5mm; PNS: OTHER-9774050943R.pns; VALUE: D2.25x5mm
OP1-OP4 = emb-IC:TLP3431: TLP3431(TP,F MOSFET Output Optocouplers Photorelay Package/Case: VSON-4 Isolation Voltage: 500 Vrms If - Forward Current: 10 mA Vf - Forward Voltage: 1.27 V Vr - Reverse Voltage: 5 V Temperature: -40ºC to 110ºC Brand: Toshiba; PNS: IC-TLP3431(TP,F.pns
OP5 OP6 = emb-IC:TLP3431: TLP3431(TP,F MOSFET Output Optocouplers Photorelay Package/Case: VSON-4 Isolation Voltage: 500 Vrms If - Forward Current: 10 mA Vf - Forward Voltage: 1.27 V Vr - Reverse Voltage: 5 V Temperature: -40ºC to 110ºC Brand: Toshiba; PNS: IC-TLP3475(TP,F.pns
PCB1 = emb-Others:EXTERNAL-PCB-COMPONENTS: PCB symbol for board BOM; PNS: OTHER-hw_DAA,BASIC-1010xx.pns
Q1 = emb-TransistorsMOSFET:SQJ465EP-T1_GE3: SQJ465EP-T1_GE3 Automotive P-Channel -60 V (D-S) 175 °C MOSFET VDS (V) = -60 VGS (V) = +-20 RDS(on) (mΩ) at VGS = -10 V = 70 RDS(on) (mΩ) at VGS = -4.5 V = 90 ID (A) = -8 Package = SO-8L; PNS: TRAN-SQJ465EP-T1_GE3.pns
Q2 = emb-TransistorsMOSFET:BSS123NH6327XTSA1: BSS123NH6327XTSA1 N-Channel MOSFET Transistor Polarity: N-Channel Package/Case: SOT-23-3 Vds - Drain-Source Breakdown Voltage: 100 V Id - Continuous Drain Current: 190 mA Rds On - Drain-Source Resistance: 6 Ohms Vgs - Gate-Source Voltage: - 20 V, + 20 V Vgs th - Gate-Source Threshold Voltage: 1.4 V Qualification: AEC-Q101 Temperature: -55ºC to 150ºC; PNS: TRAN-BSS123NH6327XTSA1.pns
Q3 Q4 = emb-TransistorsMOSFET:SQJ402EP-T1_GE3: SQJ402EP Automotive N-Channel 100 VDS 175 °C MOSFET VDS (V) = 100 RDS(on) (Ω) at VGS = 10 V = 0.011 ID (A) = 30 Package = PowerPAK SO-8L; PNS: TRAN-SQJ402EP-T1_GE3.pns
Q5 = emb-TransistorsMOSFET:DMP2006UFGQ-13: DMP2006UFGQ-13 Diodes Incorporated Transistor Polarity: P-Channel Vds - Drain-Source Breakdown Voltage: 20 V Id - Continuous Drain Current: 40 A Rds On - Drain-Source Resistance: 5.5 mOhms Vgs - Gate-Source Voltage: - 10 V, + 10 V Vgs th - Gate-Source Threshold Voltage: 1 V Qualification: AEC-Q101 Temperature: -55ºC to 150ºC; PNS: TRAN-DMP2006UFGQ-13.pns
Q6-Q20 = emb-TransistorsMOSFET:DMN2710UTQ-7: DMN2710UTQ-7 N-MOSFET Transistor Polarity: N-Channel Vds - Drain-Source Breakdown Voltage: 20 V Id - Continuous Drain Current: 870 mA Rds On - Drain-Source Resistance: 450 mOhms Vgs - Gate-Source Voltage: - 6 V, + 6 V Vgs th - Gate-Source Threshold Voltage: 0.5 V Qualification: AEC-Q101 Temperature: -55ºC to 150ºC; PNS: TRAN-DMN2710UTQ-7.pns
R1 = emb-resistors:R_: RESISTOR; PNS: RES-1M_1%_1206.pns
R2 R222 R338 = emb-resistors:R_: RESISTOR; PNS: RES-0_1%_0805.pns
R3 = emb-resistors:R_: RESISTOR; PNS: RES-4.02_1%_1206.pns
R4 R7 R17 R55 R57 R58 R60 R65 R266 = emb-resistors:R_: RESISTOR; PNS: RES-100K_1%_0402.pns
R5 R8 = emb-resistors:R_: RESISTOR; PNS: RES-49.9K_1%_0805.pns
R6 = emb-resistors:R_: RESISTOR; PNS: RES-100_2%_0207_MELF.pns
R9 R10 = emb-resistors:R_: RESISTOR; PNS: RES-1_1%_1206.pns
R11 = emb-resistors:R_: RESISTOR; PNS: RES-2.1_1%_0603.pns
R12 = emb-resistors:R_: RESISTOR; PNS: RES-39.2K_1%_0402.pns
R13 = emb-resistors:R_: RESISTOR; PNS: RES-18K_1%_0402.pns
R14 = emb-resistors:R_: RESISTOR; PNS: RES-3.4K_1%_0402.pns
R15 = emb-resistors:R_: RESISTOR; PNS: RES-133_1%_0402.pns
R16 R219 = emb-resistors:R_: RESISTOR; PNS: RES-1.5K_1%_0402.pns
R18 R22 R46 R54 R71 R73 R75 R77 R80 R81 R93 R97 R103 R106 R109 R113 R115 R117 R118 R124 R201 R202 R211 R213 R226-R233 R237 R249 R250 R255-R264 R268 R270 R272 R275 R282 R287 R298 R299 R346-R353 R356 R357 = emb-resistors:R_: RESISTOR
R19 = emb-resistors:R_: RESISTOR; PNS: RES-931_1%_0603.pns
R20 R23 R24 R40-R42 R45 R48 R52 R53 R56 R61 R63 R67 R68 R78 R79 R126 R165 R167 R171 R175-R177 R182-R184 R189-R193 R205-R208 R234 R236 R240 R241 R243 R244 R274 R276 R279 R284 R288 R289 R291 R301 = emb-resistors:R_: RESISTOR; PNS: RES-10K_1%_0402.pns
R21 R30-R32 R35-R39 R69 R70 R72 R74 R88 R98 R125 R168 R169 R209 R242 R245-R248 R251-R254 R267 R269 R271 R292-R297 R322-R329 R332 R339-R345 = emb-resistors:R_: RESISTOR; PNS: RES-0_5%_0402.pns
R25 R59 = emb-resistors:R_: RESISTOR; PNS: RES-8.66K_1%_0402.pns
R26 = emb-resistors:R_: RESISTOR; PNS: RES-20K_1%_0402.pns
R27 = emb-resistors:R_: RESISTOR; PNS: RES-154K_1%_0402.pns
R28 R283 R286 = emb-resistors:R_: RESISTOR; PNS: RES-97.6K_1%_0402.pns
R29 R285 = emb-resistors:R_: RESISTOR; PNS: RES-78.7K_1%_0402.pns
R33 R34 R43 R44 R90 R92 R94 R95 R99 R102 R104 R105 R107 R108 R110-R112 R114 R116 R119 R127-R131 R158-R160 R238 R239 R280 R281 R300 R302-R304 R354 R355 = emb-resistors:R_: RESISTOR; PNS: RES-4.7K_1%_0402.pns
R47 = emb-resistors:R_: RESISTOR; PNS: RES-15K_1%_0603.pns
R49 R50 = emb-resistors:R_: RESISTOR; PNS: RES-6.19K_1%_0603.pns
R51 = emb-resistors:R_: RESISTOR; PNS: RES-909_1%_0402.pns
R62 = emb-resistors:R_: RESISTOR; PNS: RES-33K_1%_0402.pns
R64 = emb-resistors:R_: RESISTOR; PNS: RES-110K_1%_0402.pns
R66 = emb-resistors:R_: RESISTOR; PNS: RES-47K_1%_0402.pns
R76 R84-R87 R96 R121 R220 R278 = emb-resistors:R_: RESISTOR; PNS: RES-1K_1%_0402.pns
R82 R83 = emb-resistors:R_: RESISTOR; PNS: RES-100_1%_0402.pns
R89 R100 R101 R138 R140 R142 R144 R153 R178 R179 R185 R186 R194 R195 = emb-resistors:R_: RESISTOR; PNS: RES-499_1%_0402.pns
R91 = emb-resistors:R_: RESISTOR; PNS: RES-20_1%_0402.pns
R120 = emb-resistors:R_: RESISTOR; PNS: RES-4.7M_1%_0402.pns
R122 R123 = emb-resistors:R_: RESISTOR; PNS: RES-56_1%_0402.pns
R132-R137 R139 R141 R143 R151 R152 = emb-resistors:R_: RESISTOR; PNS: RES-240_1%_0402.pns
R145 R147-R150 R154 R155 R157 R305-R321 = emb-resistors:R_: RESISTOR; PNS: RES-39_1%_0402.pns
R146 R162 R277 R290 = emb-resistors:R_: RESISTOR; PNS: RES-49.9_1%_0402.pns
R156 R161 = emb-resistors:R_: RESISTOR; PNS: RES-36_1%_0402.pns
R163 R164 R166 R170 R173 R174 R330 R331 R333-R337 = emb-resistors:R_: RESISTOR; PNS: RES-33_1%_0402.pns
R172 = emb-resistors:R_: RESISTOR; PNS: RES-4.99K_1%_0402.pns
R180 R181 R187 R188 = emb-resistors:R_: RESISTOR; PNS: RES-60.4_1%_0805.pns
R196-R200 = emb-resistors:R_: RESISTOR; PNS: RES-10_1%_330mW_0603.pns
R203 R204 = emb-resistors:R_: RESISTOR; PNS: RES-120_1%_500mW_0805.pns
R210 R212 R215 R235 = emb-resistors:R_: RESISTOR; PNS: RES-2.49K_1%_0402.pns
R214 = emb-resistors:R_: RESISTOR; PNS: RES-5.76K_1%_0402.pns
R216 R217 = emb-resistors:R_: RESISTOR; PNS: RES-2.2K_1%_0402.pns
R218 = emb-resistors:R_: RESISTOR; PNS: RES-11K_1%_0402.pns
R221 R223-R225 = emb-resistors:R_: RESISTOR; PNS: RES-75_1%_0402.pns
R265 = emb-resistors:R_: RESISTOR; PNS: RES-2K_1%_0402.pns
R273 = emb-resistors:R_: RESISTOR; PNS: RES-40.2K_1%_0402.pns
T1 = emb-Inductors:HX5008NL: HX5120NL Audio Transformers / Signal Transformers 1000Base-T NonPoE Frequency Range: 100Mhz Inductance: 350uH Isolation Voltage: 1.5kV Operating Temperature: -40°C to 85°C Number of Channels: Single Application: 1000 Base-T PoE: No; PNS: IND-HX5008NL.pns
Y1 Y3 = emb-crystals:ECS-.327-12.5-34QCS-TR: ECS-.327-12.5-34QCS-TR9 Crystal Package: 3.2mm x 1.5mm Load capacitance: 12.5 pF Frequency: 32.768 kHz Tolerance: 10 PPM ESR: 70 kOhm Qualification: AEC-Q200 Temperature: -40°C to 125ºC; PNS: OTHER-ECS-.327-12.5-34QCS-TR.pns
Y2 = emb-crystals:SIT8008BI-11-33E-33.333333: SIT8008BI-11-33E-33.333333G Standard Clock Oscillator Frequency: 33.333MHz Output Format: LVCMOS,HCMOS Frequency Stability: 20PPM Load Capacitance: 15pF Supply Voltage: 3.3V Qualification: AEC-Q100; PNS: IC-SIT8008BI-11-33E-33.333333.pns
Y4 Y6 = emb-crystals:ECS-2520MVQ-250-CN-TR: ECS-2520MVQ-250-CN-TR 25MHz CMOS Oscillator Package/Case: 2.5 mm x 2 mm Load Capacitance: 15 pF Frequency: 25 MHz Tolerance: 25 PPM Qualification: AEC-Q200 Temperature: -40ºC to 85ºC; PNS: IC-ECS-2520MVQ-250-CN-TR.pns
Y5 = emb-crystals:SIT8008BI-22-18E-37.125000: SiT8008BI-22-18E-37.125000G Standard Clock Oscillator Frequency: 37.125MHz Output Format: LVCMOS,HCMOS Frequency Stability: 25PPM Load Capacitance: 15pF Supply Voltage: 1.8V Qualification: AEC-Q100; PNS: IC-SiT8008BI-22-18E-37.125000G.pns

## Net classes
1 DIFF100: width 0.075 mm
4 COAX_50: width 0.2 mm
6 DDR4_50: width 0.075 mm
7 DDR4_90: width 0.075 mm